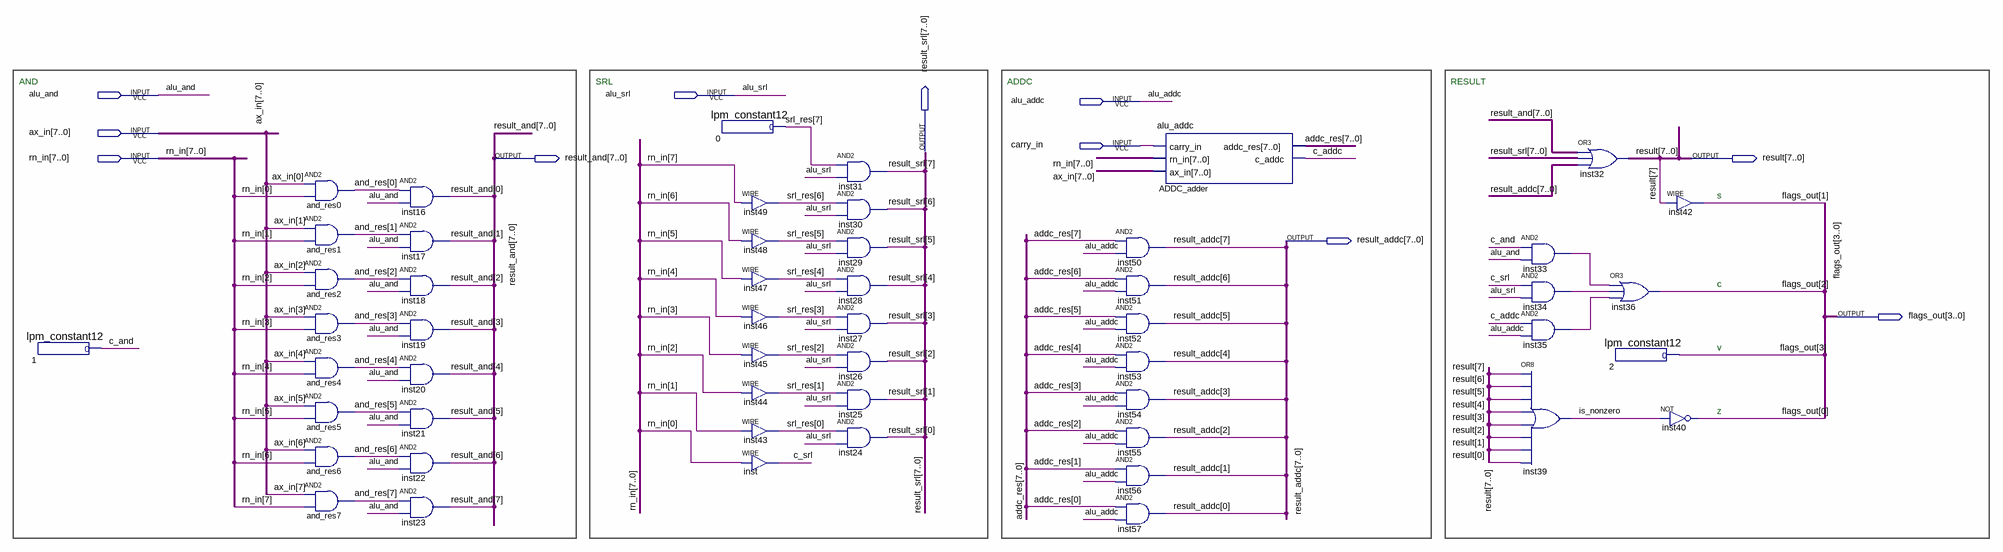
[diagram p0: schematic sheet]
// Quartus schematic alu_unit.bdf as structural Verilog: 52 symbols, 11 pins
module alu_unit (
  input  alu_and,
  input  alu_srl,
  input  alu_addc,
  input  [7:0] ax_in,
  input  carry_in,
  input  [7:0] rn_in,
  output [7:0] result_srl,
  output [7:0] result_and,
  output [7:0] result,
  output [7:0] result_addc,
  output [3:0] flags_out
);

  wire c_addc, c_and, c_srl, inst33_out, inst34_out, inst35_out, is_nonzero;
  wire [7:0] addc_res, and_res, srl_res;

  lpm_constant12 u_1 (.result(c_and));
  and and_res0 (and_res[0], ax_in[0], rn_in[0]);
  and and_res1 (and_res[1], ax_in[1], rn_in[1]);
  and and_res2 (and_res[2], ax_in[2], rn_in[2]);
  and and_res3 (and_res[3], ax_in[3], rn_in[3]);
  and and_res4 (and_res[4], ax_in[4], rn_in[4]);
  and and_res5 (and_res[5], ax_in[5], rn_in[5]);
  and and_res6 (and_res[6], ax_in[6], rn_in[6]);
  and and_res7 (and_res[7], ax_in[7], rn_in[7]);
  and inst16 (result_and[0], and_res[0], alu_and);
  and inst17 (result_and[1], and_res[1], alu_and);
  and inst18 (result_and[2], and_res[2], alu_and);
  and inst19 (result_and[3], and_res[3], alu_and);
  and inst20 (result_and[4], and_res[4], alu_and);
  and inst21 (result_and[5], and_res[5], alu_and);
  and inst22 (result_and[6], and_res[6], alu_and);
  and inst23 (result_and[7], and_res[7], alu_and);
  lpm_constant12 u_0 (.result(srl_res[7]));
  assign srl_res[6] = rn_in[7];  // WIRE inst49
  assign srl_res[5] = rn_in[6];  // WIRE inst48
  assign srl_res[4] = rn_in[5];  // WIRE inst47
  assign srl_res[3] = rn_in[4];  // WIRE inst46
  assign srl_res[2] = rn_in[3];  // WIRE inst45
  assign srl_res[1] = rn_in[2];  // WIRE inst44
  assign srl_res[0] = rn_in[1];  // WIRE inst43
  assign c_srl = rn_in[0];  // WIRE inst
  and inst31 (result_srl[7], srl_res[7], alu_srl);
  and inst30 (result_srl[6], srl_res[6], alu_srl);
  and inst29 (result_srl[5], srl_res[5], alu_srl);
  and inst28 (result_srl[4], srl_res[4], alu_srl);
  and inst27 (result_srl[3], srl_res[3], alu_srl);
  and inst26 (result_srl[2], srl_res[2], alu_srl);
  and inst25 (result_srl[1], srl_res[1], alu_srl);
  and inst24 (result_srl[0], srl_res[0], alu_srl);
  and inst50 (result_addc[7], addc_res[7], alu_addc);
  and inst51 (result_addc[6], addc_res[6], alu_addc);
  and inst52 (result_addc[5], addc_res[5], alu_addc);
  and inst53 (result_addc[4], addc_res[4], alu_addc);
  and inst54 (result_addc[3], addc_res[3], alu_addc);
  and inst55 (result_addc[2], addc_res[2], alu_addc);
  and inst56 (result_addc[1], addc_res[1], alu_addc);
  and inst57 (result_addc[0], addc_res[0], alu_addc);
  alu_addc ADDC_adder (.carry_in(carry_in), .rn_in(rn_in), .ax_in(ax_in), .addc_res(addc_res), .c_addc(c_addc));
  and inst33 (inst33_out, c_and, alu_and);
  and inst34 (inst34_out, c_srl, alu_srl);
  and inst35 (inst35_out, c_addc, alu_addc);
  or inst39 (is_nonzero, result[7], result[6], result[5], result[4], result[3], result[2], result[1], result[0]);
  assign result = result_and | result_srl | result_addc;  // OR3 inst32, 8 bits wide
  lpm_constant12 u_2 (.result(flags_out[3]));
  or inst36 (flags_out[2], inst33_out, inst34_out, inst35_out);
  assign flags_out[1] = result[7];  // WIRE inst42
  not inst40 (flags_out[0], is_nonzero);

  // Notes on the sheet:
  //   AND
  //   SRL
  //   ADDC
  //   RESULT
  //   s
  //   c
  //   v
  //   z
endmodule
